# Altium schematic sheet MercurialSDR_FPGA_Banks.SchDoc
size A4
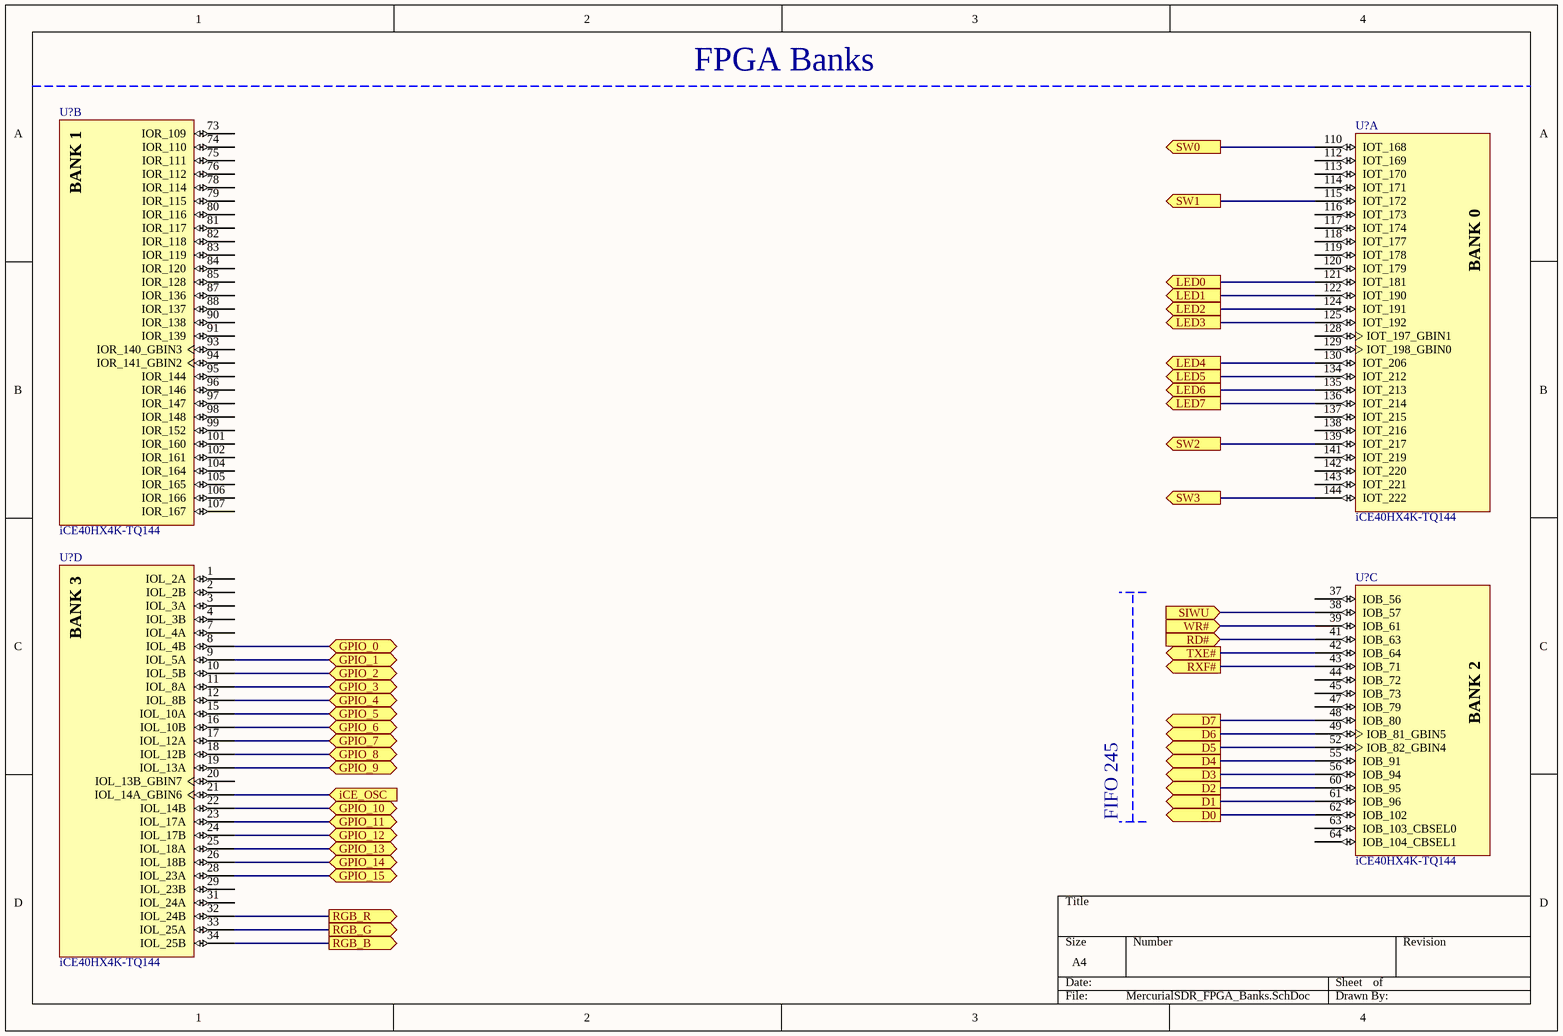
[diagram p0: MercurialSDR_FPGA_Banks.SchDoc]

## Parts
(Parts that share a designator on the sheet are numbered #1, #2 ... from top to bottom, then left to right.)
U?#1  iCE40HX4K-TQ144  [LATC-TQFP-144_L]  (part B of 6)
U?#2  iCE40HX4K-TQ144  [LATC-TQFP-144_L]  (part A of 6)
U?#3  iCE40HX4K-TQ144  [LATC-TQFP-144_L]  (part D of 6)
U?#4  iCE40HX4K-TQ144  [LATC-TQFP-144_L]  (part C of 6)

## Ports
D0 (out), D1 (out), D2 (out), D3 (out), D4 (out), D5 (out), D6 (out), D7 (out), GPIO_0 (bidir), GPIO_1 (bidir), GPIO_2 (bidir), GPIO_3 (bidir), GPIO_4 (bidir), GPIO_5 (bidir), GPIO_6 (bidir), GPIO_7 (bidir), GPIO_8 (bidir), GPIO_9 (bidir), GPIO_10 (bidir), GPIO_11 (bidir), GPIO_12 (bidir), GPIO_13 (bidir), GPIO_14 (bidir), GPIO_15 (bidir), iCE_OSC (in), LED0 (out), LED1 (out), LED2 (out), LED3 (out), LED4 (out), LED5 (out), LED6 (out), LED7 (out), RD# (in), RGB_B (out), RGB_G (out), RGB_R (out), RXF# (out), SIWU (in), SW0 (out), SW1 (out), SW2 (out), SW3 (out), TXE# (out), WR# (in)

## Nets
D0: U?#4.62(IOB_102) ; port D0
D1: U?#4.61(IOB_96) ; port D1
D2: U?#4.60(IOB_95) ; port D2
D3: U?#4.56(IOB_94) ; port D3
D4: U?#4.55(IOB_91) ; port D4
D5: U?#4.52(IOB_82_GBIN4) ; port D5
D6: U?#4.49(IOB_81_GBIN5) ; port D6
D7: U?#4.48(IOB_80) ; port D7
GPIO_0: U?#3.8(IOL_4B) ; port GPIO_0
GPIO_1: U?#3.9(IOL_5A) ; port GPIO_1
GPIO_2: U?#3.10(IOL_5B) ; port GPIO_2
GPIO_3: U?#3.11(IOL_8A) ; port GPIO_3
GPIO_4: U?#3.12(IOL_8B) ; port GPIO_4
GPIO_5: U?#3.15(IOL_10A) ; port GPIO_5
GPIO_6: U?#3.16(IOL_10B) ; port GPIO_6
GPIO_7: U?#3.17(IOL_12A) ; port GPIO_7
GPIO_8: U?#3.18(IOL_12B) ; port GPIO_8
GPIO_9: U?#3.19(IOL_13A) ; port GPIO_9
GPIO_10: U?#3.22(IOL_14B) ; port GPIO_10
GPIO_11: U?#3.23(IOL_17A) ; port GPIO_11
GPIO_12: U?#3.24(IOL_17B) ; port GPIO_12
GPIO_13: U?#3.25(IOL_18A) ; port GPIO_13
GPIO_14: U?#3.26(IOL_18B) ; port GPIO_14
GPIO_15: U?#3.28(IOL_23A) ; port GPIO_15
iCE_OSC: U?#3.21(IOL_14A_GBIN6) ; port iCE_OSC
LED0: U?#2.121(IOT_181) ; port LED0
LED1: U?#2.122(IOT_190) ; port LED1
LED2: U?#2.124(IOT_191) ; port LED2
LED3: U?#2.125(IOT_192) ; port LED3
LED4: U?#2.130(IOT_206) ; port LED4
LED5: U?#2.134(IOT_212) ; port LED5
LED6: U?#2.135(IOT_213) ; port LED6
LED7: U?#2.136(IOT_214) ; port LED7
RD#: U?#4.41(IOB_63) ; port RD#
RGB_B: U?#3.34(IOL_25B) ; port RGB_B
RGB_G: U?#3.33(IOL_25A) ; port RGB_G
RGB_R: U?#3.32(IOL_24B) ; port RGB_R
RXF#: U?#4.43(IOB_71) ; port RXF#
SIWU: U?#4.38(IOB_57) ; port SIWU
SW0: U?#2.110(IOT_168) ; port SW0
SW1: U?#2.115(IOT_172) ; port SW1
SW2: U?#2.139(IOT_217) ; port SW2
SW3: U?#2.144(IOT_222) ; port SW3
TXE#: U?#4.42(IOB_64) ; port TXE#
WR#: U?#4.39(IOB_61) ; port WR#

Not connected (* = marked no-connect by the designer): U?#1 73(IOR_109) 74(IOR_110) 75(IOR_111) 76(IOR_112) 78(IOR_114) 79(IOR_115) 80(IOR_116) 81(IOR_117) 82(IOR_118) 83(IOR_119) 84(IOR_120) 85(IOR_128) 87(IOR_136) 88(IOR_137) 90(IOR_138) 91(IOR_139) 93(IOR_140_GBIN3) 94(IOR_141_GBIN2) 95(IOR_144) 96(IOR_146) 97(IOR_147) 98(IOR_148) 99(IOR_152) 101(IOR_160) 102(IOR_161) 104(IOR_164) 105(IOR_165) 106(IOR_166) 107(IOR_167); U?#2 112(IOT_169) 113(IOT_170) 114(IOT_171) 116(IOT_173) 117(IOT_174) 118(IOT_177) 119(IOT_178) 120(IOT_179) 128(IOT_197_GBIN1) 129(IOT_198_GBIN0) 137(IOT_215) 138(IOT_216) 141(IOT_219) 142(IOT_220) 143(IOT_221); U?#3 1(IOL_2A) 2(IOL_2B) 3(IOL_3A) 4(IOL_3B) 7(IOL_4A) 20(IOL_13B_GBIN7) 29(IOL_23B) 31(IOL_24A); U?#4 37(IOB_56) 44(IOB_72) 45(IOB_73) 47(IOB_79) 63(IOB_103_CBSEL0) 64(IOB_104_CBSEL1)

## Notes on the sheet
- FPGA Banks
- FIFO 245
- (in symbol ICE40HX4K-TQ144, part A) BANK 0
- (in symbol ICE40HX4K-TQ144, part B) BANK 1
- (in symbol ICE40HX4K-TQ144, part C) BANK 2
- (in symbol ICE40HX4K-TQ144, part D) BANK 3

## Library data of the parts
U?#1-U?#4 = ICE40HX4K-TQ144: iCE40 HX4K Series FPGA Family, 3520 Logic Cells, 1.2 V Core, 80 K Embedded RAM Bits, 144-pin TQFP, Pb-Free, Tray; Manufacturer: Lattice Semiconductor; Phase-Locked Loops: 2; Supply Voltage: 1.2V; Logic Cells: 3520; Embedded RAM Bits: 80K; ComponentLink1Description: Manufacturer URL; ComponentLink2Description: Datasheet; DatasheetVersion: Rev. 02.9; Mounting Technology: Surface Mount; ComponentLink3URL: http://www.latticesemi.com/lit/docs/package/pkg.pdf; ComponentLink3Description: Package Specification; ComponentLink1URL: http://www.latticesemi.com/en; ComponentLink2URL: http://www.latticesemi.com/~/media/Documents/DataSheets/iCE/iCE40LPHXFamilyDataSheet.pdf; PackageReference: TQFP-144; Packing: Tray; PartNumber: ICE40HX4K-TQ144; PackageDescription: 144-Pin Thin Quad Flat Package, Body 20 x 20 mm, Pitch 0.5 mm; PackageVersion: Rev. 03.9, 02/2013; RoHS: TRUE